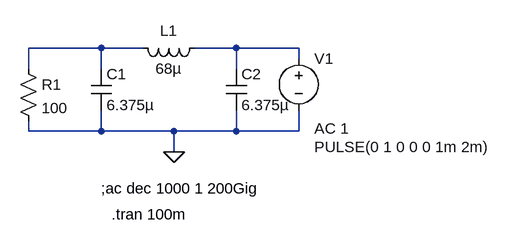
[diagram p0: schematic Pi-Filter.asc]
Pi-Filter.asc, the LTspice schematic file:
Version 4
SHEET 1 880 680
WIRE 176 96 64 96
WIRE 240 96 176 96
WIRE 384 96 320 96
WIRE 480 96 384 96
WIRE 480 112 480 96
WIRE 64 128 64 96
WIRE 176 128 176 96
WIRE 384 128 384 96
WIRE 64 224 64 208
WIRE 176 224 176 192
WIRE 176 224 64 224
WIRE 288 224 176 224
WIRE 384 224 384 192
WIRE 384 224 288 224
WIRE 480 224 480 192
WIRE 480 224 384 224
WIRE 288 256 288 224
FLAG 288 256 0
SYMBOL cap 160 128 R0
SYMATTR InstName C1
SYMATTR Value 6.375µ
SYMATTR SpiceLine Rser=0.01 Lser=500p
SYMBOL voltage 480 96 R0
WINDOW 123 24 124 Left 2
WINDOW 39 24 152 Left 2
WINDOW 3 24 152 Left 2
SYMATTR Value2 AC 1
SYMATTR Value PULSE(0 1 0 0 0 1m 2m)
SYMATTR InstName V1
SYMBOL cap 368 128 R0
SYMATTR InstName C2
SYMATTR Value 6.375µ
SYMATTR SpiceLine Rser=0.01 Lser=500p
SYMBOL ind 336 80 R90
WINDOW 0 5 56 VBottom 2
WINDOW 3 32 56 VTop 2
SYMATTR InstName L1
SYMATTR Value 68µ
SYMATTR SpiceLine Rser=2.6 Cpar=2.3p
SYMBOL res 48 112 R0
SYMATTR InstName R1
SYMATTR Value 100
TEXT 176 312 Left 2 !;ac dec 1000 1 200Gig
TEXT 192 352 Left 2 !.tran 100m

The netlist it stands for:
* Pi-Filter.asc
C1 N001 0 6.375µ Rser=0.01 Lser=500p
V1 N002 0 PULSE(0 1 0 0 0 1m 2m) AC 1
C2 N002 0 6.375µ Rser=0.01 Lser=500p
L1 N002 N001 68µ Rser=2.6 Cpar=2.3p
R1 N001 0 100
;ac dec 1000 1 200Gig
.tran 100m
.backanno
.end